# Altium schematic sheet ABDO Schematic.SchDoc
size A4; SheetNumber: 1; SheetTotal: 1
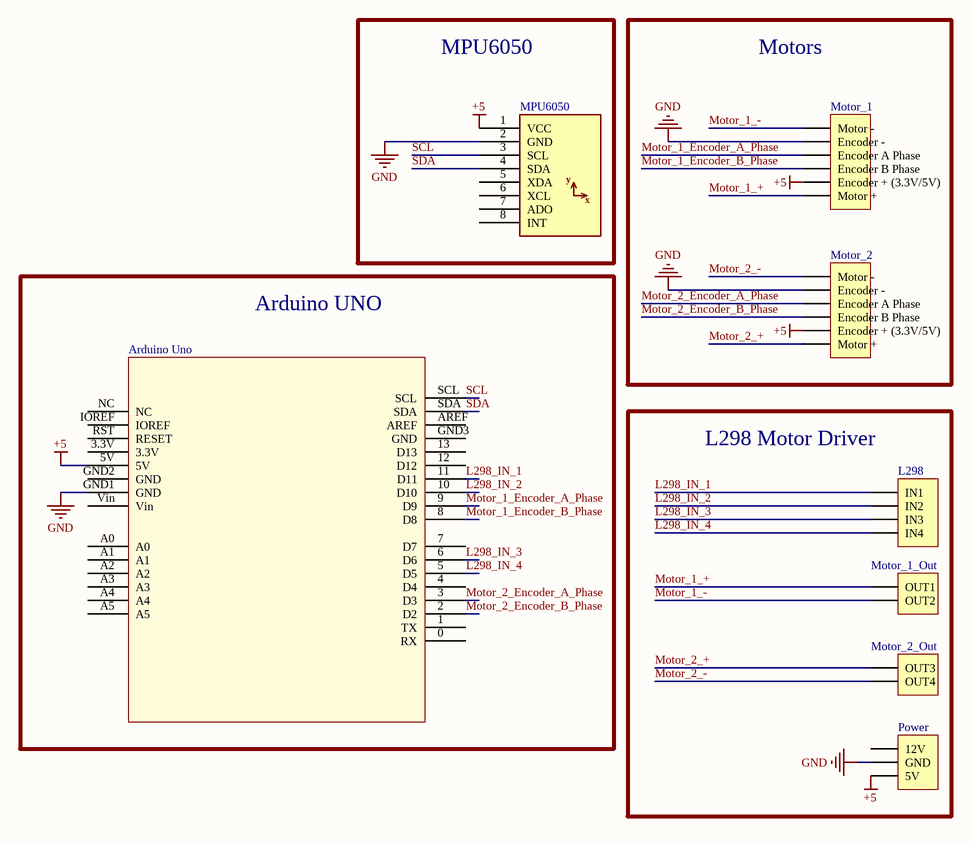
[diagram p0: ABDO Schematic.SchDoc]

## Parts
Arduino_Uno  ARDUINO UNO  [ARDUINO UNO]  (value not drawn)
L298  Header 4  [HDR1X4]  (value not drawn)
Motor_1  Header 6  [HDR1X6]  (value not drawn)
Motor_1_Out  Header 2  [HDR1X2]  (value not drawn)
Motor_2  Header 6  [HDR1X6]  (value not drawn)
Motor_2_Out  Header 2  [HDR1X2]  (value not drawn)
MPU6050  MPU6050  [MPU6050]  (value not drawn)
Power  Header 3  [HDR1X3]  (value not drawn)

## Blocks framed on the sheet
MPU6050: MPU6050
Motors: Motor_1 Motor_2
Arduino UNO: Arduino_Uno
L298 Motor Driver: L298 Motor_1_Out Motor_2_Out Power

## Nets
+5: Arduino_Uno.5V Motor_1.5(Encoder_+_(3.3V/5V)) Motor_2.5(Encoder_+_(3.3V/5V)) MPU6050.1(VCC) Power.3(5V)
GND: Arduino_Uno.GND1(GND) Motor_1.2(Encoder_-) Motor_2.2(Encoder_-) MPU6050.2(GND) Power.2(GND)
L298_IN_1: Arduino_Uno.11(D11) L298.1(IN1)
L298_IN_2: Arduino_Uno.10(D10) L298.2(IN2)
L298_IN_3: Arduino_Uno.6(D6) L298.3(IN3)
L298_IN_4: Arduino_Uno.5(D5) L298.4(IN4)
Motor_1_+: Motor_1.6(Motor_+) Motor_1_Out.1(OUT1)
Motor_1_-: Motor_1.1(Motor_-) Motor_1_Out.2(OUT2)
Motor_1_Encoder_A_Phase: Arduino_Uno.9(D9) Motor_1.3(Encoder_A_Phase)
Motor_1_Encoder_B_Phase: Arduino_Uno.8(D8) Motor_1.4(Encoder_B_Phase)
Motor_2_+: Motor_2.6(Motor_+) Motor_2_Out.1(OUT3)
Motor_2_-: Motor_2.1(Motor_-) Motor_2_Out.2(OUT4)
Motor_2_Encoder_A_Phase: Arduino_Uno.3(D3) Motor_2.3(Encoder_A_Phase)
Motor_2_Encoder_B_Phase: Arduino_Uno.2(D2) Motor_2.4(Encoder_B_Phase)
SCL: Arduino_Uno.SCL MPU6050.3(SCL)
SDA: Arduino_Uno.SDA MPU6050.4(SDA)

Not connected (* = marked no-connect by the designer): Arduino_Uno 0(RX) 1(TX) 3.3V 4(D4) 7(D7) 12(D12) 13(D13) A0 A1 A2 A3 A4 A5 AREF GND2(GND) GND3(GND) IOREF NC RST(RESET) Vin; MPU6050 5(XDA) 6(XCL) 7(ADO) 8(INT); Power 1(12V)

## Notes on the sheet
- (in symbol MPU6050) y; x

## Library data of the parts
L298 = Header 4: Header, 4-Pin; LatestRevisionDate: 17-Jul-2002; LatestRevisionNote: Re-released for DXP Platform.; Publisher: Altium Limited
Motor_1 Motor_2 = Header 6: Header, 6-Pin; LatestRevisionDate: 17-Jul-2002; LatestRevisionNote: Re-released for DXP Platform.; Publisher: Altium Limited
Motor_1_Out Motor_2_Out = Header 2: Header, 2-Pin; LatestRevisionDate: 17-Jul-2002; LatestRevisionNote: Re-released for DXP Platform.; Publisher: Altium Limited
MPU6050 = MPU6050: IMU ACCEL/GYRO 3-AXIS I2C; ComponentLink1Description: Datasheet; ComponentLink1URL: https://invensense.tdk.com/wp-content/uploads/2015/02/MPU-6000-Datasheet1.pdf
Power = Header 3: Header, 3-Pin; LatestRevisionDate: 17-Jul-2002; LatestRevisionNote: Re-released for DXP Platform.; Publisher: Altium Limited